# Altium project TM4C123G.PrjPcb (part 2 of 2)
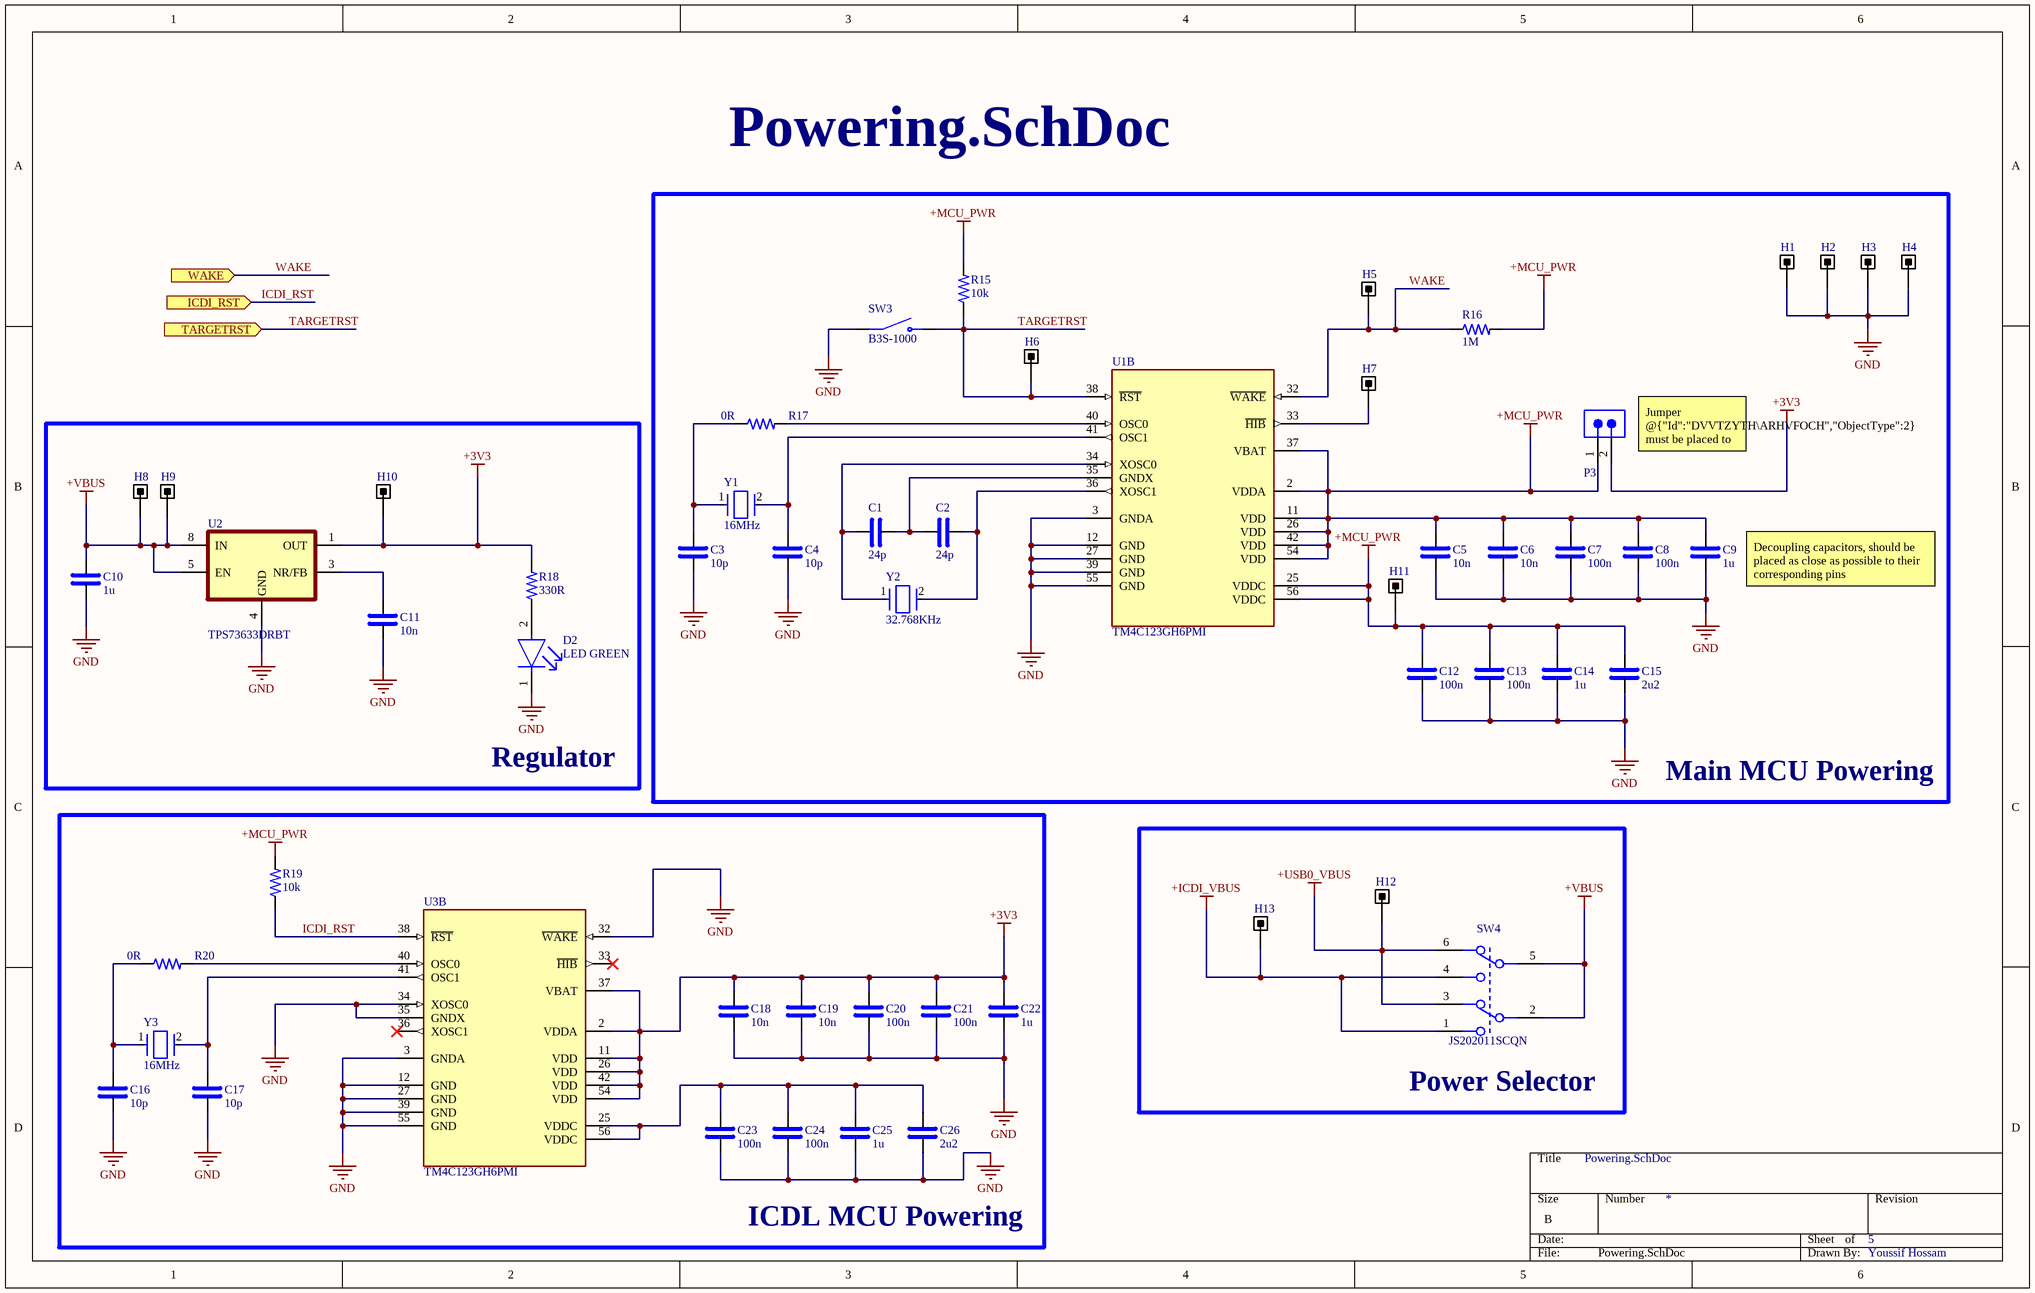
[diagram p6: Powering.SchDoc]

## Nets that join several sheets
+3V3: Connectors (P1.1), ICDI (R24.2 R25.2 U3.45), Powering (15 pins)
+ICDI_VBUS: Connectors (J2.1), ICDI (R23.2), Powering (H13.1 SW4.1 SW4.4)
+MCU_PWR: ICDI (R21.2 R22.2), LEDS_SWITCHS (D1.1), Powering (22 pins)
+USB0_VBUS: Main_MCU (R1.2), Connectors (J1.1), Powering (H12.1 SW4.3 SW4.6)
+VBUS: Connectors (P1.2), Powering (7 pins)
GND: Connectors (9 pins), LEDS_SWITCHS (5 pins), Powering (44 pins)
DEBUG_TCK/SWCLK: Main_MCU (H18.1 U1.52), ICDI (R22.1 U3.19 U3.30)
DEBUG_TDI: Main_MCU (H20.1 U1.50), ICDI (U3.22)
DEBUG_TDO/SWO: Main_MCU (H21.1 U1.49), ICDI (U3.21 U3.53)
DEBUG_TMS/SWDIO: Main_MCU (H19.1 U1.51), ICDI (R21.1 U3.20 U3.29)
ICDI_RST: Connectors (J3.10), Powering (R19.1 U3.38)
ICDI_TCK: Connectors (J3.4), ICDI (R24.1 U3.52)
ICDI_TDI: Connectors (J3.8), ICDI (U3.50)
ICDI_TDO: Connectors (J3.6), ICDI (U3.49)
ICDI_TMS: Connectors (J3.2), ICDI (R25.1 U3.51)
ICDL_USB_N: Connectors (J2.2), ICDI (U3.43)
ICDL_USB_P: Connectors (J2.3), ICDI (U3.44)
LED_B: Main_MCU (R5.2), LEDS_SWITCHS (Q2.1)
LED_G: Main_MCU (R6.2), LEDS_SWITCHS (Q3.1)
LED_R: Main_MCU (R4.2), LEDS_SWITCHS (Q1.1)
PA2: Main_MCU (U1.19), Connectors (P2.20)
PA3: Main_MCU (U1.20), Connectors (P2.18)
PA4: Main_MCU (U1.21), Connectors (P2.16)
PA5: Main_MCU (U1.22), Connectors (P1.15)
PA6: Main_MCU (U1.23), Connectors (P1.17)
PA7: Main_MCU (U1.24), Connectors (P1.19)
PB0: Main_MCU (R1.1 U1.45), Connectors (P1.5)
PB1: Main_MCU (R2.1 U1.46), Connectors (P1.7)
PB2: Main_MCU (U1.47), Connectors (P2.4)
PB3: Main_MCU (U1.48), Connectors (P2.5)
PB4: Main_MCU (U1.58), Connectors (P1.13)
PB5: Main_MCU (U1.57), Connectors (P1.3)
PB6: Main_MCU (R8.2 U1.1), Connectors (P2.14)
PB7: Main_MCU (R9.2 U1.4), Connectors (P2.12)
PC4: Main_MCU (U1.16), Connectors (P2.7)
PC5: Main_MCU (U1.15), Connectors (P2.9)
PC6: Main_MCU (U1.14), Connectors (P2.11)
PC7: Main_MCU (U1.13), Connectors (P2.13)
PD0: Main_MCU (R8.1 U1.61), Connectors (P1.6)
PD1: Main_MCU (R9.1 U1.62), Connectors (P1.8)
PD2: Main_MCU (U1.63), Connectors (P1.10)
PD3: Main_MCU (U1.64), Connectors (P1.12)
PD6: Main_MCU (U1.53), Connectors (P2.15)
PD7: Main_MCU (U1.10), Connectors (P2.17)
PE0: Main_MCU (U1.9), Connectors (P2.6)
PE1: Main_MCU (U1.8), Connectors (P1.14)
PE2: Main_MCU (U1.7), Connectors (P1.16)
PE3: Main_MCU (U1.6), Connectors (P1.18)
PE4: Main_MCU (U1.59), Connectors (P1.9)
PE5: Main_MCU (U1.60), Connectors (P1.11)
PF0: Main_MCU (R3.1 U1.28), Connectors (P2.8)
PF1: Main_MCU (R4.1 U1.29), Connectors (P1.20)
PF2: Main_MCU (R5.1 U1.30), Connectors (P2.1)
PF3: Main_MCU (R6.1 U1.31), Connectors (P2.3)
PF4: Main_MCU (R7.1 U1.5), Connectors (P2.19)
TARGETRST: Connectors (P2.10), ICDI (U3.23), Powering (H6.1 R15.1 SW3.4 U1.38)
U0RX_VCP_TXD: Main_MCU (H16.1 U1.17), ICDI (U3.18)
U0TX_VCP_RXD: Main_MCU (H17.1 U1.18), ICDI (U3.17)
USB0_ID: Main_MCU (R2.2), Connectors (J1.4)
USB0_N: Main_MCU (U1.43), Connectors (J1.2)
USB0_P: Main_MCU (U1.44), Connectors (J1.3)
USR_SW1: Main_MCU (R7.2), LEDS_SWITCHS (SW1.2)
USR_SW2: Main_MCU (R3.2), LEDS_SWITCHS (SW2.2), Powering (H5.1 R16.1 U1.32)